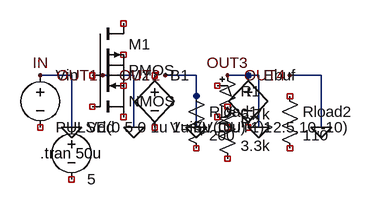
[diagram p0: schematic ltspice_multistage.asc]
ltspice_multistage.asc, the LTspice schematic file:
Version 4
SHEET 1 880 680

WIRE 64 80 16 80
WIRE 160 80 112 80
WIRE 256 80 208 80
WIRE 352 80 304 80
WIRE 448 80 400 80

WIRE 64 160 64 80
WIRE 160 160 160 80
WIRE 256 160 256 80
WIRE 352 160 352 80
WIRE 448 160 448 80

FLAG 16 80 IN
FLAG 112 80 OUT1
FLAG 208 80 OUT2
FLAG 304 80 OUT3
FLAG 400 80 OUT4
FLAG 64 160 0
FLAG 160 160 0
FLAG 256 160 0
FLAG 352 160 0
FLAG 448 160 0

SYMBOL voltage 16 64 R0
SYMATTR InstName Vin
SYMATTR Value PULSE(0 5 0 1u 1u 5u 10u)

SYMBOL voltage 64 144 R0
SYMATTR InstName Vdd
SYMATTR Value 5

SYMBOL nmos 96 48 R0
SYMATTR InstName M2
SYMATTR Value NMOS

SYMBOL pmos 96 0 R0
SYMATTR InstName M1
SYMATTR Value PMOS

SYMBOL bv 192 64 R0
SYMATTR InstName B1
SYMATTR Value V=if(V(OUT1)>2.5,10,-10)

SYMBOL res 240 96 R0
SYMATTR InstName Rload1
SYMATTR Value 200

SYMBOL res 288 64 R0
SYMATTR InstName R1
SYMATTR Value 6.7k

SYMBOL res 288 112 R0
SYMATTR InstName R2
SYMATTR Value 3.3k

SYMBOL e 336 64 R0
SYMATTR InstName Ebuf
SYMATTR Value 1

SYMBOL res 384 96 R0
SYMATTR InstName Rload2
SYMATTR Value 110

TEXT 16 200 Left 2 !.tran 50u

The netlist it stands for:
* ltspice_multistage.asc
Vin 0 NC_01 PULSE(0 5 0 1u 1u 5u 10u)
Vdd 0 NC_02 5
M2 NC_03 NC_04 NC_05 NC_05 NMOS
M1 NC_06 NC_07 NC_08 NC_08 PMOS
B1 NC_09 NC_10 V=if(V(OUT1)>2.5,10,-10)
Rload1 0 NC_11 200
R1 0 NC_12 6.7k
R2 NC_13 NC_14 3.3k
Ebuf 0 NC_15 NC_16 NC_17 1
Rload2 NC_18 NC_19 110
.model NMOS NMOS
.model PMOS PMOS
.lib standard.mos
.tran 50u
.backanno
.end